# Altium schematic sheet DifferentialToSingle.SchDoc
size A4; Address1: TH Nürnberg; Address2: Georg Simon Ohm; Address3: Kesslerplatz 10; Address4: 90489 Nürnberg; SheetNumber: 5; SheetTotal: 8
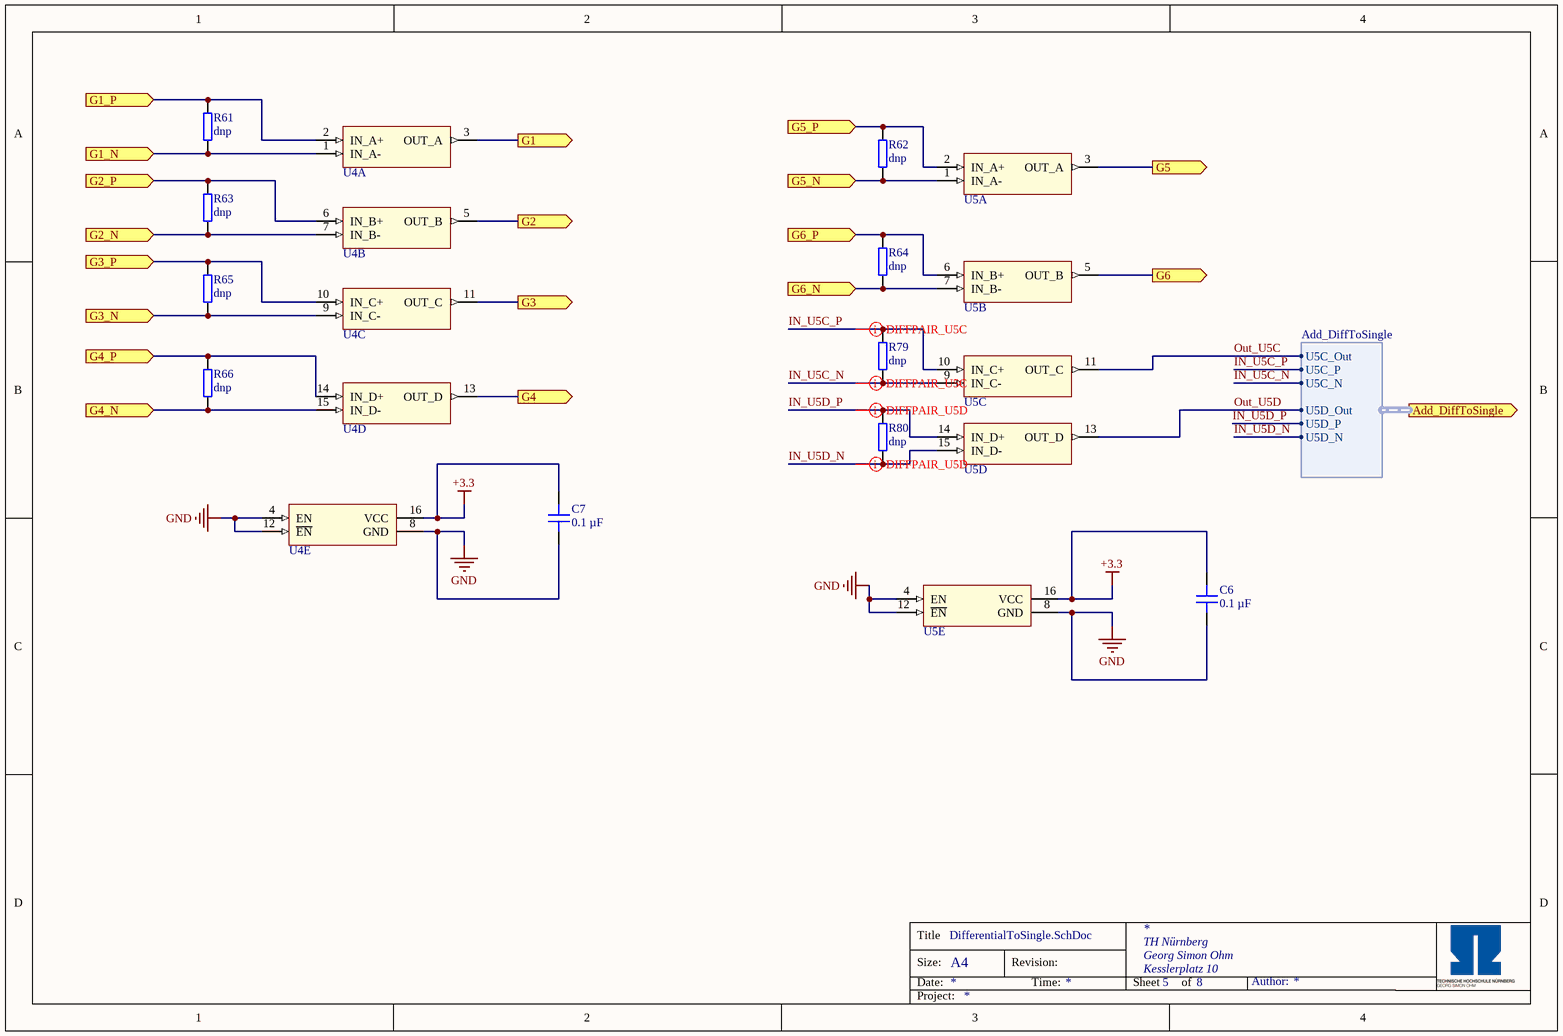
[diagram p0: DifferentialToSingle.SchDoc]

## Parts
C6  0.1 µF  [C_0603]
C7  0.1 µF  [C_0603]
R61  dnp  [RES 0603_1608]
R62  dnp  [RES 0603_1608]
R63  dnp  [RES 0603_1608]
R64  dnp  [RES 0603_1608]
R65  dnp  [RES 0603_1608]
R66  dnp  [RES 0603_1608]
R79  dnp  [RES 0603_1608]
R80  dnp  [RES 0603_1608]
U4  DS26LV32ATM/NOPB  [TI_D-R-PDSO-G16_N]  (value not drawn)  (parts A,B,C,D,E of 5)
U5  DS26LV32ATM/NOPB  [TI_D-R-PDSO-G16_N]  (value not drawn)  (parts A,B,C,D,E of 5)

## Ports
Add_DiffToSingle (out, harness Add_DiffToSingle), G1 (out), G1_N (in), G1_P (in), G2 (out), G2_N (in), G2_P (in), G3 (out), G3_N (in), G3_P (in), G4 (out), G4_N (in), G4_P (in), G5 (out), G5_N (in), G5_P (in), G6 (out), G6_N (in), G6_P (in)

## Harnesses
Add_DiffToSingle: U5C_Out, U5C_P, U5C_N, U5D_Out, U5D_P, U5D_N

## Nets
+3.3: C6.2 C7.2 U4.16(VCC) U5.16(VCC)
GND: C6.1 C7.1 U4.4(EN) U4.8(GND) U4.12(~{EN}) U5.4(EN) U5.8(GND) U5.12(~{EN})
G1: U4.3(OUT_A) ; port G1
G1_N: R61.1 U4.1(IN_A-) ; port G1_N
G1_P: R61.2 U4.2(IN_A+) ; port G1_P
G2: U4.5(OUT_B) ; port G2
G2_N: R63.1 U4.7(IN_B-) ; port G2_N
G2_P: R63.2 U4.6(IN_B+) ; port G2_P
G3: U4.11(OUT_C) ; port G3
G3_N: R65.1 U4.9(IN_C-) ; port G3_N
G3_P: R65.2 U4.10(IN_C+) ; port G3_P
G4: U4.13(OUT_D) ; port G4
G4_N: R66.1 U4.15(IN_D-) ; port G4_N
G4_P: R66.2 U4.14(IN_D+) ; port G4_P
G5: U5.3(OUT_A) ; port G5
G5_N: R62.1 U5.1(IN_A-) ; port G5_N
G5_P: R62.2 U5.2(IN_A+) ; port G5_P
G6: U5.5(OUT_B) ; port G6
G6_N: R64.1 U5.7(IN_B-) ; port G6_N
G6_P: R64.2 U5.6(IN_B+) ; port G6_P
IN_U5C_N: R79.1 U5.9(IN_C-) ; port Add_DiffToSingle.U5C_N
IN_U5C_P: R79.2 U5.10(IN_C+) ; port Add_DiffToSingle.U5C_P
IN_U5D_N: R80.1 U5.15(IN_D-) ; port Add_DiffToSingle.U5D_N
IN_U5D_P: R80.2 U5.14(IN_D+) ; port Add_DiffToSingle.U5D_P
Out_U5C: U5.11(OUT_C) ; port Add_DiffToSingle.U5C_Out
Out_U5D: U5.13(OUT_D) ; port Add_DiffToSingle.U5D_Out

## Layout directives
differential pair: IN_U5C_N, IN_U5C_P, IN_U5D_N, IN_U5D_P

## Notes on the sheet
- Title
- Size:
- Date:
- A4
- Revision:
- Time:
- Sheet
- of
- Author:
- Project:

## Library data of the parts
C6 C7 = C0603X104K5RAC7411: Capacitor 0603, 50 VDC, 0.1 µF, X7R; Manufacturer: KEMET; Tolerance: 10 %; Voltage Rating: 50 VDC; Created from: MGremer; Manufacturer Part Number: C0603X104K5RAC7411; PartID: 3; Created On: 20.12.2020 13:54:13; ComponentLink1Description: Datasheet; ComponentLink1URL: https://www.mouser.de/datasheet/2/212/1/KEM_C1013_X7R_FT_CAP_SMD-1103280.pdf; Component Type: Capacitor 0603; Device Package: 0603; Last Updated: 04.03.2021 09:24:28; Mounting Type: SMD; Operating Temperature: -55 - 125°C; Series: SMD Comm X7R Flex; Supplier 1: Mouser; Supplier Part Number 1: 80-C0603X104K5R7411; Type: Capacitor; Value: 0.1 µF; Live Cycle Status: 1; Stock number: Labor SMD Container; LCSC Part Number: C14663; Supplier 2: LCSC; Supplier Part Number 2: C14663
R61-R66 R79 R80 = -: SMD resistor E24 series; Created from: MGremer; Manufacturer Part Number: -; PartID: 147; Created On: 14.12.2020 16:17:14; ComponentLink1Description: Datasheet; ComponentLink1URL: -; Component Type: SMD resistor; Device Package: 0603; Last Updated: 02.03.2021 14:07:32; Manufacturer: -; Mounting Type: SMD; Supplier 1: -; Supplier Part Number 1: -; Type: Resistor; Tolerance: -; Value: dnp; Live Cycle Status: 1; Stock number: Labor SMD Container
U4 U5 = DS26LV32ATM/NOPB: 3V Enhanced CMOS Quad Differential Line Receiver, 16-pin Narrow SOIC, Pb-Free; Manufacturer: Texas Instruments; Created from: T. Wendt; Manufacturer Part Number: DS26LV32ATM/NOPB; PartID: 2; Created On: 01.03.2021 10:35:45; ComponentLink1Description: Datasheet; ComponentLink1URL: http://www.ti.com/general/docs/lit/getliterature.tsp?genericPartNumber=DS26LV32AT&fileType=pdf; Component Type: RS422 Receiver; Device Package: SOIC; Last Updated: 04.03.2021 09:04:43; Minimum Order: 1; Mounting Type: SMD; Operating Temperature: -40°C - 85°C; Series: DS26LV32; Supplier 1: Mouser; Supplier Part Number 1: 926-DS26LV32ATM/NOPB; Supplier 2: Mouser; Supplier Part Number 2: 926-DS26LV32ATMXNOPB; Supplier 3: LCSC; Supplier Part Number 3: C59861; Type: Standard; Live Cycle Status: 1; Stock number: not stored; LCSC Part Number: C59861